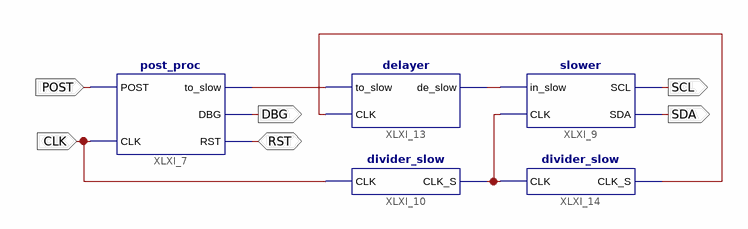
[diagram p0: schematic sheet 1]
// Xilinx ISE schematic overall.sch (xbr) as structural Verilog: 5 symbols, 6 ports
module overall (
  input  POST,
  input  CLK,
  inout  RST,
  output DBG,
  output SDA,
  output SCL
);

  wire XLXN_70, XLXN_74, XLXN_76, XLXN_116;

  post_proc XLXI_7 (.POST(POST), .CLK(CLK), .to_slow(XLXN_70), .DBG(DBG), .RST(RST));
  delayer XLXI_13 (.to_slow(XLXN_70), .CLK(XLXN_74), .de_slow(XLXN_76));
  slower XLXI_9 (.SCL(SCL), .SDA(SDA), .CLK(XLXN_116), .in_slow(XLXN_76));
  divider_slow XLXI_10 (.CLK(CLK), .CLK_S(XLXN_116));
  divider_slow XLXI_14 (.CLK(XLXN_116), .CLK_S(XLXN_74));
endmodule
